# Altium schematic sheet Arduin_uno_Rev3_schematic.SchDoc
size B; SheetNumber: 1; SheetTotal: 1
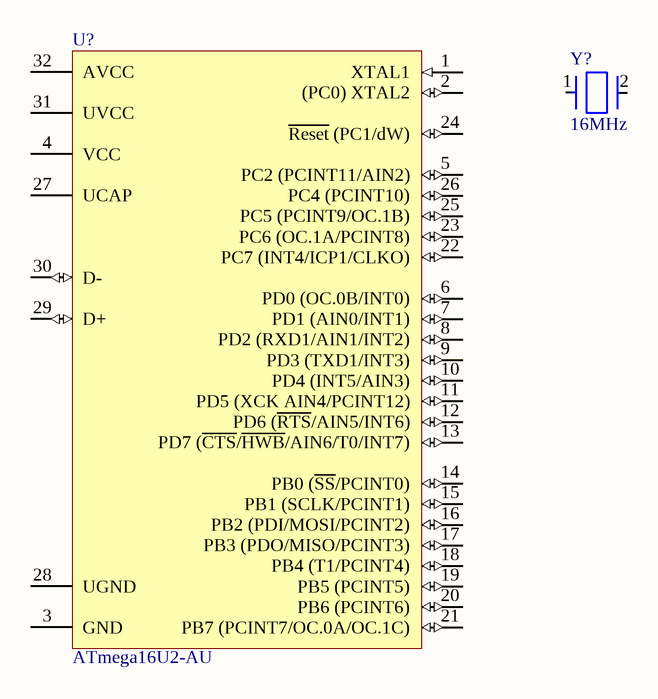
[diagram p0: Arduin_uno_Rev3_schematic.SchDoc]

## Parts
U?  ATmega16U2-AU  [32A_M]
Y?  16MHz  [FP-ECX-53-MFG]

## Nets

Not connected (* = marked no-connect by the designer): U? 1(XTAL1) 2((PC0)_XTAL2) 3(GND) 4(VCC) 5(PC2_(PCINT11/AIN2)) 6(PD0_(OC.0B/INT0)) 7(PD1_(AIN0/INT1)) 8(PD2_(RXD1/AIN1/INT2)) 9(PD3_(TXD1/INT3)) 10(PD4_(INT5/AIN3)) 11(PD5_(XCK_AIN4/PCINT12)) 12(PD6_(~{RTS}/AIN5/INT6)) 13(PD7_(~{CTS}/~{HWB}/AIN6/T0/INT7)) 14(PB0_(~{SS}/PCINT0)) 15(PB1_(SCLK/PCINT1)) 16(PB2_(PDI/MOSI/PCINT2)) 17(PB3_(PDO/MISO/PCINT3)) 18(PB4_(T1/PCINT4)) 19(PB5_(PCINT5)) 20(PB6_(PCINT6)) 21(PB7_(PCINT7/OC.0A/OC.1C)) 22(PC7_(INT4/ICP1/CLKO)) 23(PC6_(OC.1A/PCINT8)) 24(~{Reset}_(PC1/dW)) 25(PC5_(PCINT9/OC.1B)) 26(PC4_(PCINT10)) 27(UCAP) 28(UGND) 29(D+) 30(D-) 31(UVCC) 32(AVCC); Y? 1(In/Out) 2(Out/In)

## Library data of the parts
U? = CMP-0095-00303-3: 8-bit AVR Microcontroller, 2.7-5.5V, 16KB Flash, 512 Bytes EEPROM, 512 Bytes SRAM, 32-pin TQFP, Industrial Grade (-40°C to 85°C); RevisionNote: Schematic symbol corrected; PartNumber: ATmega16U2-AU; ComponentLink1URL: http://www.atmel.com/; ComponentLink2Description: ATmega8U2/16U2/32U2 Datasheet; PackageDescription: 32-Lead, 7x7x1.0 mm Body, 0.8mm Lead Pitch, Thin Profile Plastic Quad Flat Package (TQFP); Code_JEDEC: MS-026-ABA; DatasheetVersion: revD, Nov-2010; ComponentLink2URL: http://www.atmel.com/dyn/resources/prod_documents/doc7799.pdf; ComponentLink3URL: http://www.atmel.com/dyn/resources/prod_documents/7799S.pdf; ComponentLink3Description: ATmega8U2/16U2/32U2 Summary; PackageReference: 32A; PackageVersion: revC, Oct-2010; ComponentLink1Description: Manufacturer URL
Y? = CMP-40224-000045-1: CRYSTAL 16.0000MHZ 12PF SMD